# Altium project WOLF.PrjPcb
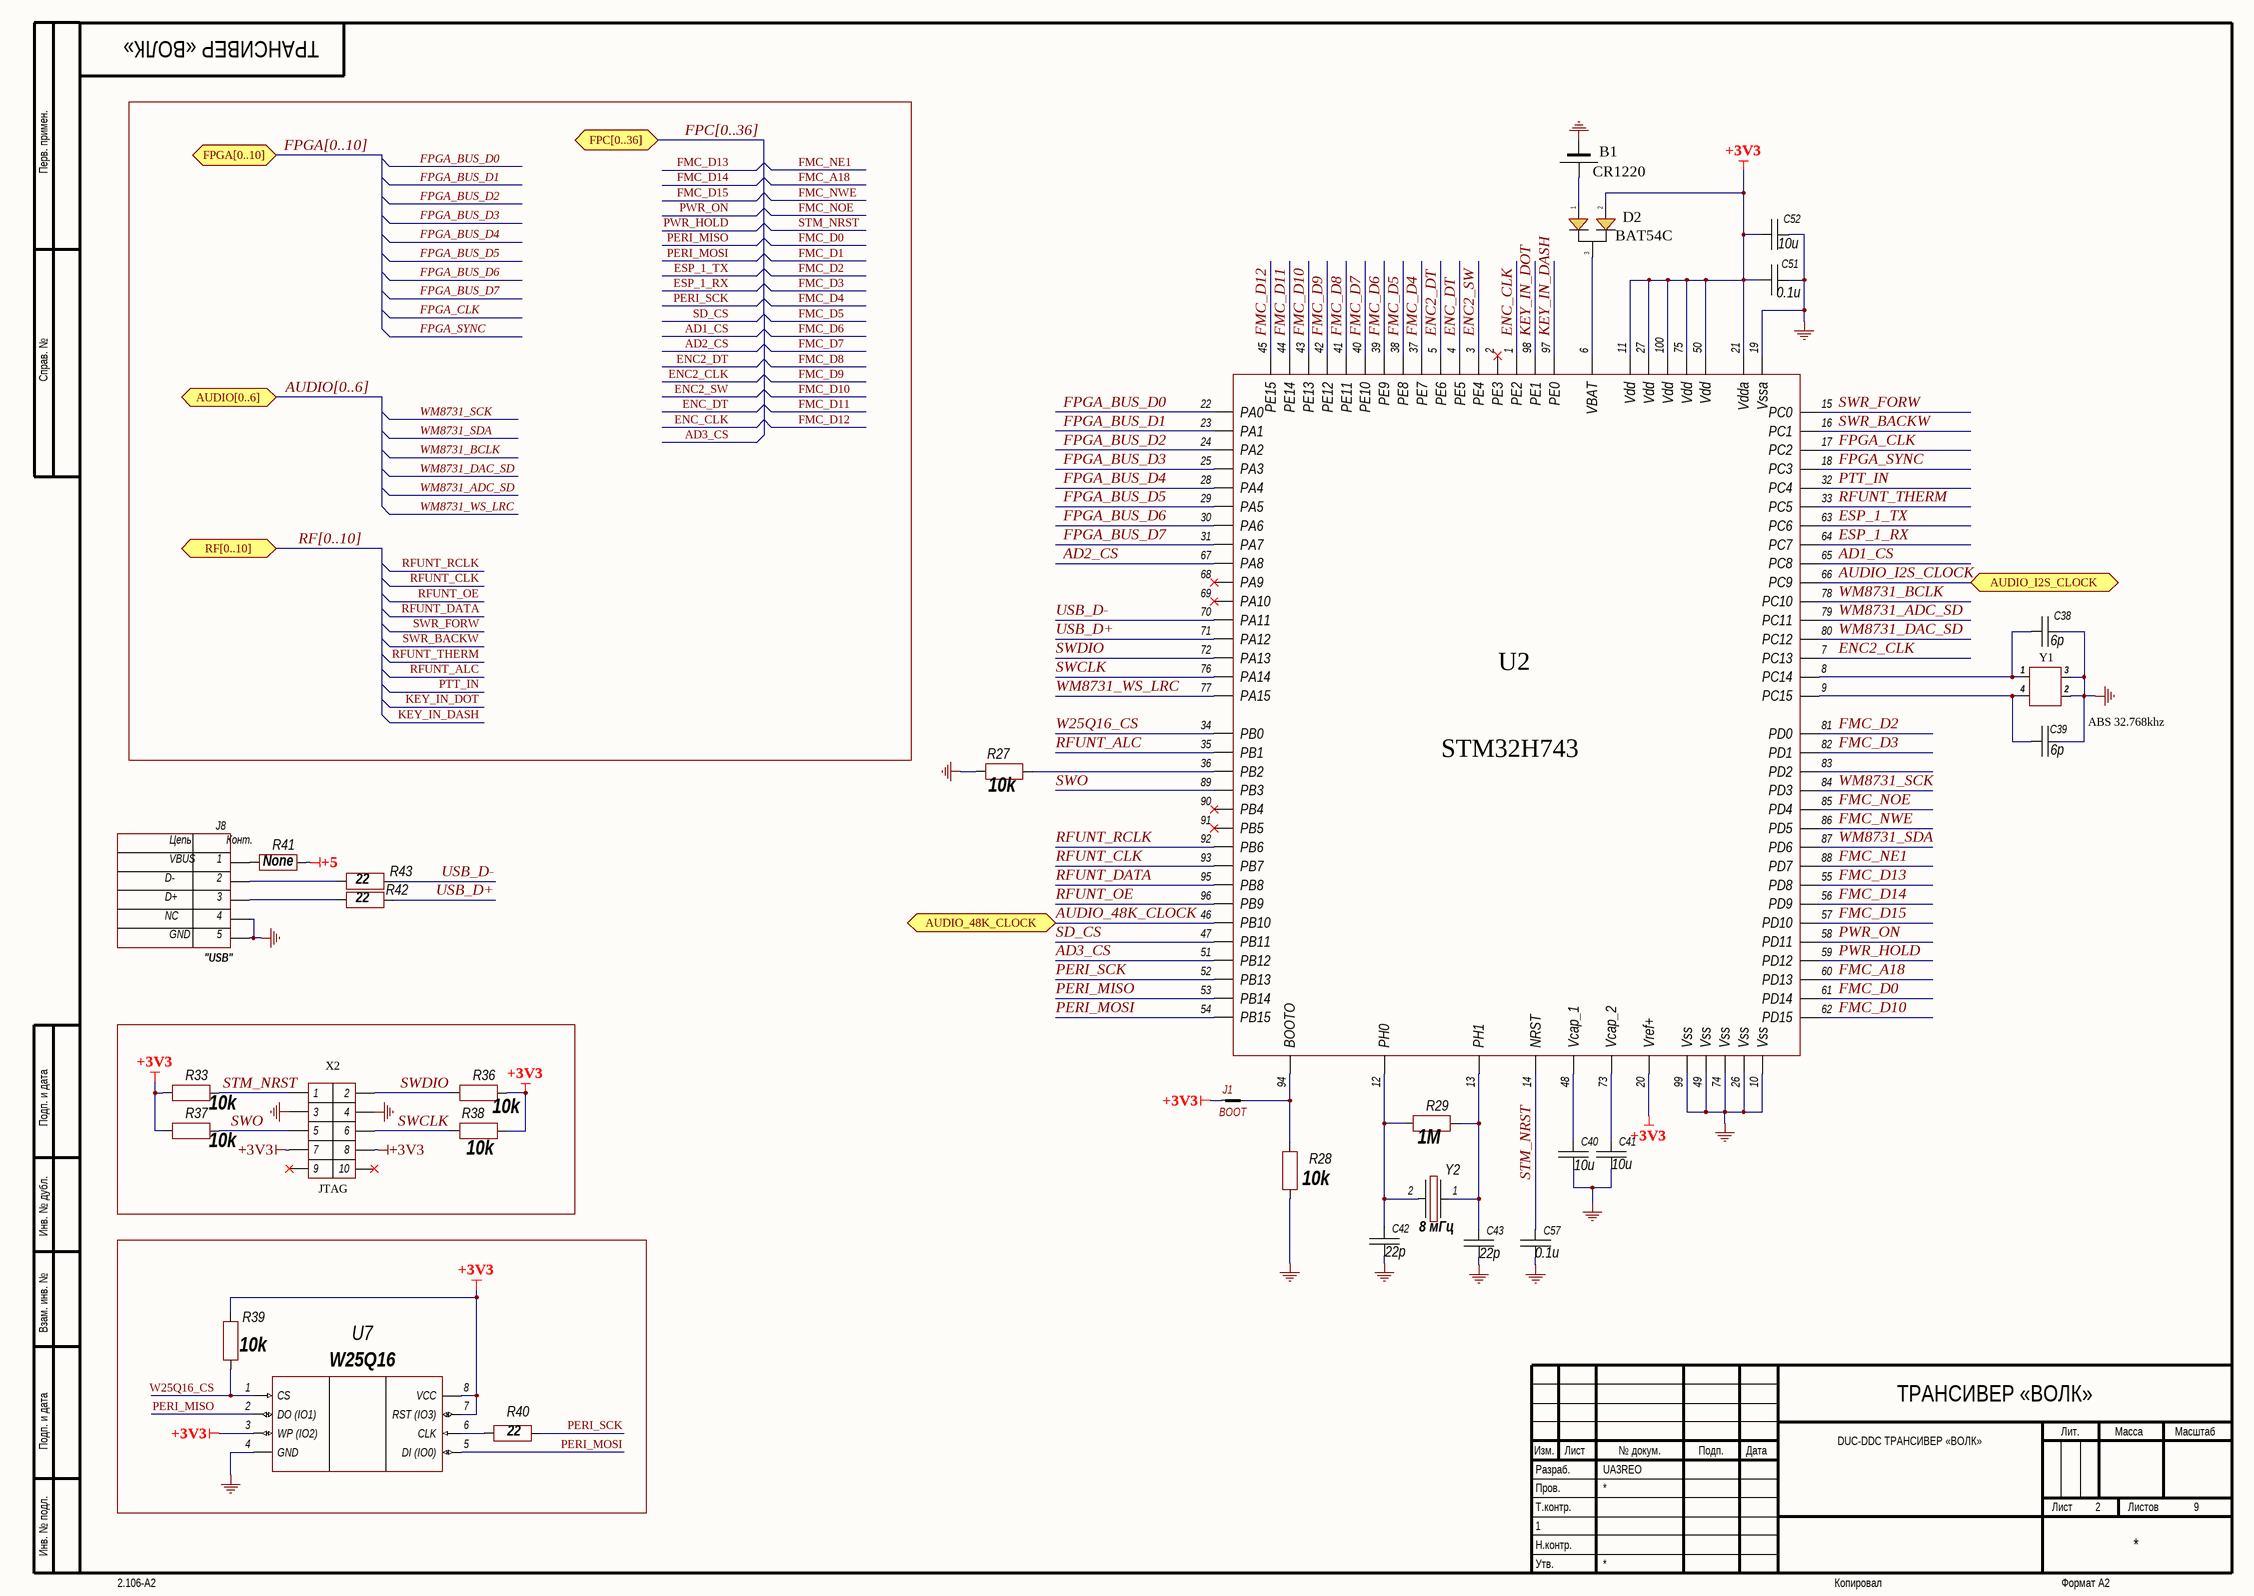
[diagram p0: WL-STM.SchDoc]
3 sheets, 75 parts. Net scope: global (net labels, ports and power ports of the same name join across sheets).
Board file: WOLF-MAIN.PcbDoc
Sheets:
  WL-STM.SchDoc
  WL-FPGA.SchDoc
  WL-GENERATOR.SchDoc

## Sheet WL-STM.SchDoc: DUC-DDC ТРАНСИВЕР «ВОЛК»
size 594 x 420 mm; Date: 16.10.2020; Author: UA3REO; DrawnBy: 1; Engineer: 1; Organization: 1; DocumentNumber: ТРАНСИВЕР «ВОЛК»; Revision: 1; SheetNumber: 2; SheetTotal: 9; Time: «ВОЛК»; Rule: 16.12.2020; ImagePath: 1

### Parts
B1  CR1220  [CR2032]
C38  6p  [CH0805C]
C39  6p  [CH0805C]
C40  10u  [CH0805C]
C41  10u  [CH0805C]
C42  22p  [CH0805C]
C43  22p  [CH0805C]
C51  0.1u  [CH0805C]
C52  10u  [CH0805C]
C57  0.1u  [CH0805C]
D2  BAT54C  [SOT23_132]
J1  BOOT  [CON: PLS-2]
J8  "USB"  [CON: 0675031020]
R27  10k  [CH0805R]
R28  10k  [CH0805R]
R29  1M  [CH0805R]
R33  10k  [CH0805R]
R36  10k  [CH0805R]
R37  10k  [CH0805R]
R38  10k  [CH0805R]
R39  10k  [CH0805R]
R40  22  [CH0805R]
R41  None  [CH0805R]
R42  22  [CH0805R]
R43  22  [CH0805R]
U2  STM32H743  [100-LQFP]
U7  W25Q16  [SOIC-8-1]
X2  JTAG  [CON: PLD-10]
Y1  ABS 32.768khz  [ABS-25]
Y2  8 мГц  [OSC-dip]

### Ports
AUDIO[0..6] (bidir), AUDIO_48K_CLOCK (bidir), AUDIO_I2S_CLOCK (bidir), FPC[0..36] (bidir), FPGA[0..10] (bidir), RF[0..10] (bidir)

### Nets
+3V3: C51.1 C52.1 D2.2 J1.2 R33.2 R36.1 R37.2 R38.1 R39.2 U2.11(Vdd) U2.20(Vref+) U2.21(Vdda) U2.27(Vdd) U2.50(Vdd) U2.75(Vdd) U2.100(Vdd) U7.3(WP_(IO2)) U7.7(RST_(IO3)) U7.8(VCC) X2.7 X2.8
+5: R41.1
GND: B1.2 C38.2 C39.2 C40.1 C41.1 C42.1 C43.1 C51.2 C52.2 C57.1 J8.4 J8.5 R27.2 R28.1 U2.10(Vss) U2.19(Vssa) U2.26(Vss) U2.49(Vss) U2.74(Vss) U2.99(Vss) U7.4(GND) X2.3 X2.4 Y1.2 Y1.3
AD1_CS: U2.65(PC8)
AD2_CS: U2.67(PA8)
AD3_CS: U2.51(PB12)
AUDIO_48K_CLOCK: U2.46(PB10) ; port AUDIO_48K_CLOCK
AUDIO_I2S_CLOCK: U2.66(PC9) ; port AUDIO_I2S_CLOCK
ENC2_CLK: U2.7(PC13)
ENC2_DT: U2.5(PE6)
ENC2_SW: U2.3(PE4)
ENC_CLK: U2.1(PE2)
ENC_DT: U2.4(PE5)
ESP_1_RX: U2.64(PC7)
ESP_1_TX: U2.63(PC6)
FMC_A18: U2.60(PD13)
FMC_D0: U2.61(PD14)
FMC_D2: U2.81(PD0)
FMC_D3: U2.82(PD1)
FMC_D4: U2.37(PE7)
FMC_D5: U2.38(PE8)
FMC_D6: U2.39(PE9)
FMC_D7: U2.40(PE10)
FMC_D8: U2.41(PE11)
FMC_D9: U2.42(PE12)
FMC_D10: U2.43(PE13) U2.62(PD15)
FMC_D11: U2.44(PE14)
FMC_D12: U2.45(PE15)
FMC_D13: U2.55(PD8)
FMC_D14: U2.56(PD9)
FMC_D15: U2.57(PD10)
FMC_NE1: U2.88(PD7)
FMC_NOE: U2.85(PD4)
FMC_NWE: U2.86(PD5)
FPGA_BUS_D0: U2.22(PA0)
FPGA_BUS_D1: U2.23(PA1)
FPGA_BUS_D2: U2.24(PA2)
FPGA_BUS_D3: U2.25(PA3)
FPGA_BUS_D4: U2.28(PA4)
FPGA_BUS_D5: U2.29(PA5)
FPGA_BUS_D6: U2.30(PA6)
FPGA_BUS_D7: U2.31(PA7)
FPGA_CLK: U2.17(PC2)
FPGA_SYNC: U2.18(PC3)
KEY_IN_DASH: U2.97(PE0)
KEY_IN_DOT: U2.98(PE1)
PERI_MISO: U2.53(PB14) U7.2(DO_(IO1))
PERI_MOSI: U2.54(PB15) U7.5(DI_(IO0))
PERI_SCK: R40.2 U2.52(PB13)
PTT_IN: U2.32(PC4)
PWR_HOLD: U2.59(PD12)
PWR_ON: U2.58(PD11)
RFUNT_ALC: U2.35(PB1)
RFUNT_CLK: U2.93(PB7)
RFUNT_DATA: U2.95(PB8)
RFUNT_OE: U2.96(PB9)
RFUNT_RCLK: U2.92(PB6)
RFUNT_THERM: U2.33(PC5)
SD_CS: U2.47(PB11)
STM_NRST: C57.2 U2.14(NRST)
SWCLK: R38.2 U2.76(PA14) X2.6
SWDIO: R36.2 U2.72(PA13) X2.2
SWO: R37.1 U2.89(PB3) X2.5
SWR_BACKW: U2.16(PC1)
SWR_FORW: U2.15(PC0)
USB_D+: R42.1 U2.71(PA12)
USB_D-: R43.1 U2.70(PA11)
W25Q16_CS: R39.1 U2.34(PB0) U7.1(CS)
WM8731_ADC_SD: U2.79(PC11)
WM8731_BCLK: U2.78(PC10)
WM8731_DAC_SD: U2.80(PC12)
WM8731_SCK: U2.84(PD3)
WM8731_SDA: U2.87(PD6)
WM8731_WS_LRC: U2.77(PA15)
NetB1_1: B1.1 D2.1
NetC38_1: C38.1 U2.8(PC14) Y1.1
NetC39_1: C39.1 U2.9(PC15) Y1.4
NetC40_2: C40.2 U2.48(Vcap_1)
NetC41_2: C41.2 U2.73(Vcap_2)
NetC42_2: C42.2 R29.2 U2.12(PH0) Y2.2
NetC43_2: C43.2 R29.1 U2.13(PH1) Y2.1
NetD2_3: D2.3 U2.6(VBAT)
NetJ1_1: J1.1 R28.2 U2.94(BOOTO)
NetJ8_1: J8.1 R41.2
NetJ8_2: J8.2 R43.2
NetJ8_3: J8.3 R42.2
NetR27_1: R27.1 U2.36(PB2)
NetR33_1: R33.1 X2.1
NetR40_1: R40.1 U7.6(CLK)

Not connected (* = marked no-connect by the designer): U2 2(PE3)* 68(PA9)* 69(PA10)* 83(PD2) 90(PB4)* 91(PB5)*; X2 9* 10*

### Buses and harness runs
bus AUDIO[0..6] = port AUDIO[0..6]
bus FPC[0..36] = port FPC[0..36]
bus FPGA[0..10] = port FPGA[0..10]
bus RF[0..10] = port RF[0..10]

### Notes on the sheet
- Labels drawn without touching a wire or pin: STM_NRST
- Перв. примен.
- Справ. №
- Подп. и дата
- Инв. № дубл.
- Взам. инв. №
- Разраб.
- Изм.
- Лист
- № докум.
- Подп.
- Дата
- Лит.
- Масса
- Масштаб
- Пров.
- Т.контр.
- Листов
- Инв. № подл.
- Утв.
- Н.контр.
- 2.106-A2
- Копировал
- Формат А2
- (in symbol miniUSB-B) Цепь; Конт.; VBUS; D-; D+; NC; GND

### Library data of the parts
B1 = POWER_BAT
C38-C43 C51 C52 C57 = Capacitor: Manufacturer: *; Model: *; HelpURL: *; ComponentKind: *; Value: *
J1 = DJAMPER
J8 = miniUSB-B: USB; Manufacturer: *; Model: *; HelpURL: *; ComponentKind: *
R27-R29 R33 R36-R43 = Resistor: Manufacturer: *; Model: *; HelpURL: *; ComponentKind: *; Value: *
U7 = W25Q32JVZPIQ: Flash; Manufacturer: Winbond Electronics; Model: W25Q32JVZPIQ; HelpURL: https://www.digikey.com/product-detail/en/winbond-electronics/W25Q32JVZPIQ/W25Q32JVZPIQ-ND/6167525; ComponentKind: 8-WSON
Y1 = ABS25
Y2 = Oscillator: Manufacturer: *; Model: *; HelpURL: *; ComponentKind: *; Value: *

## Sheet WL-FPGA.SchDoc
size 594 x 420 mm; DocumentNumber: ТРАНСИВЕР «ВОЛК»; SheetNumber: 3; SheetTotal: 3
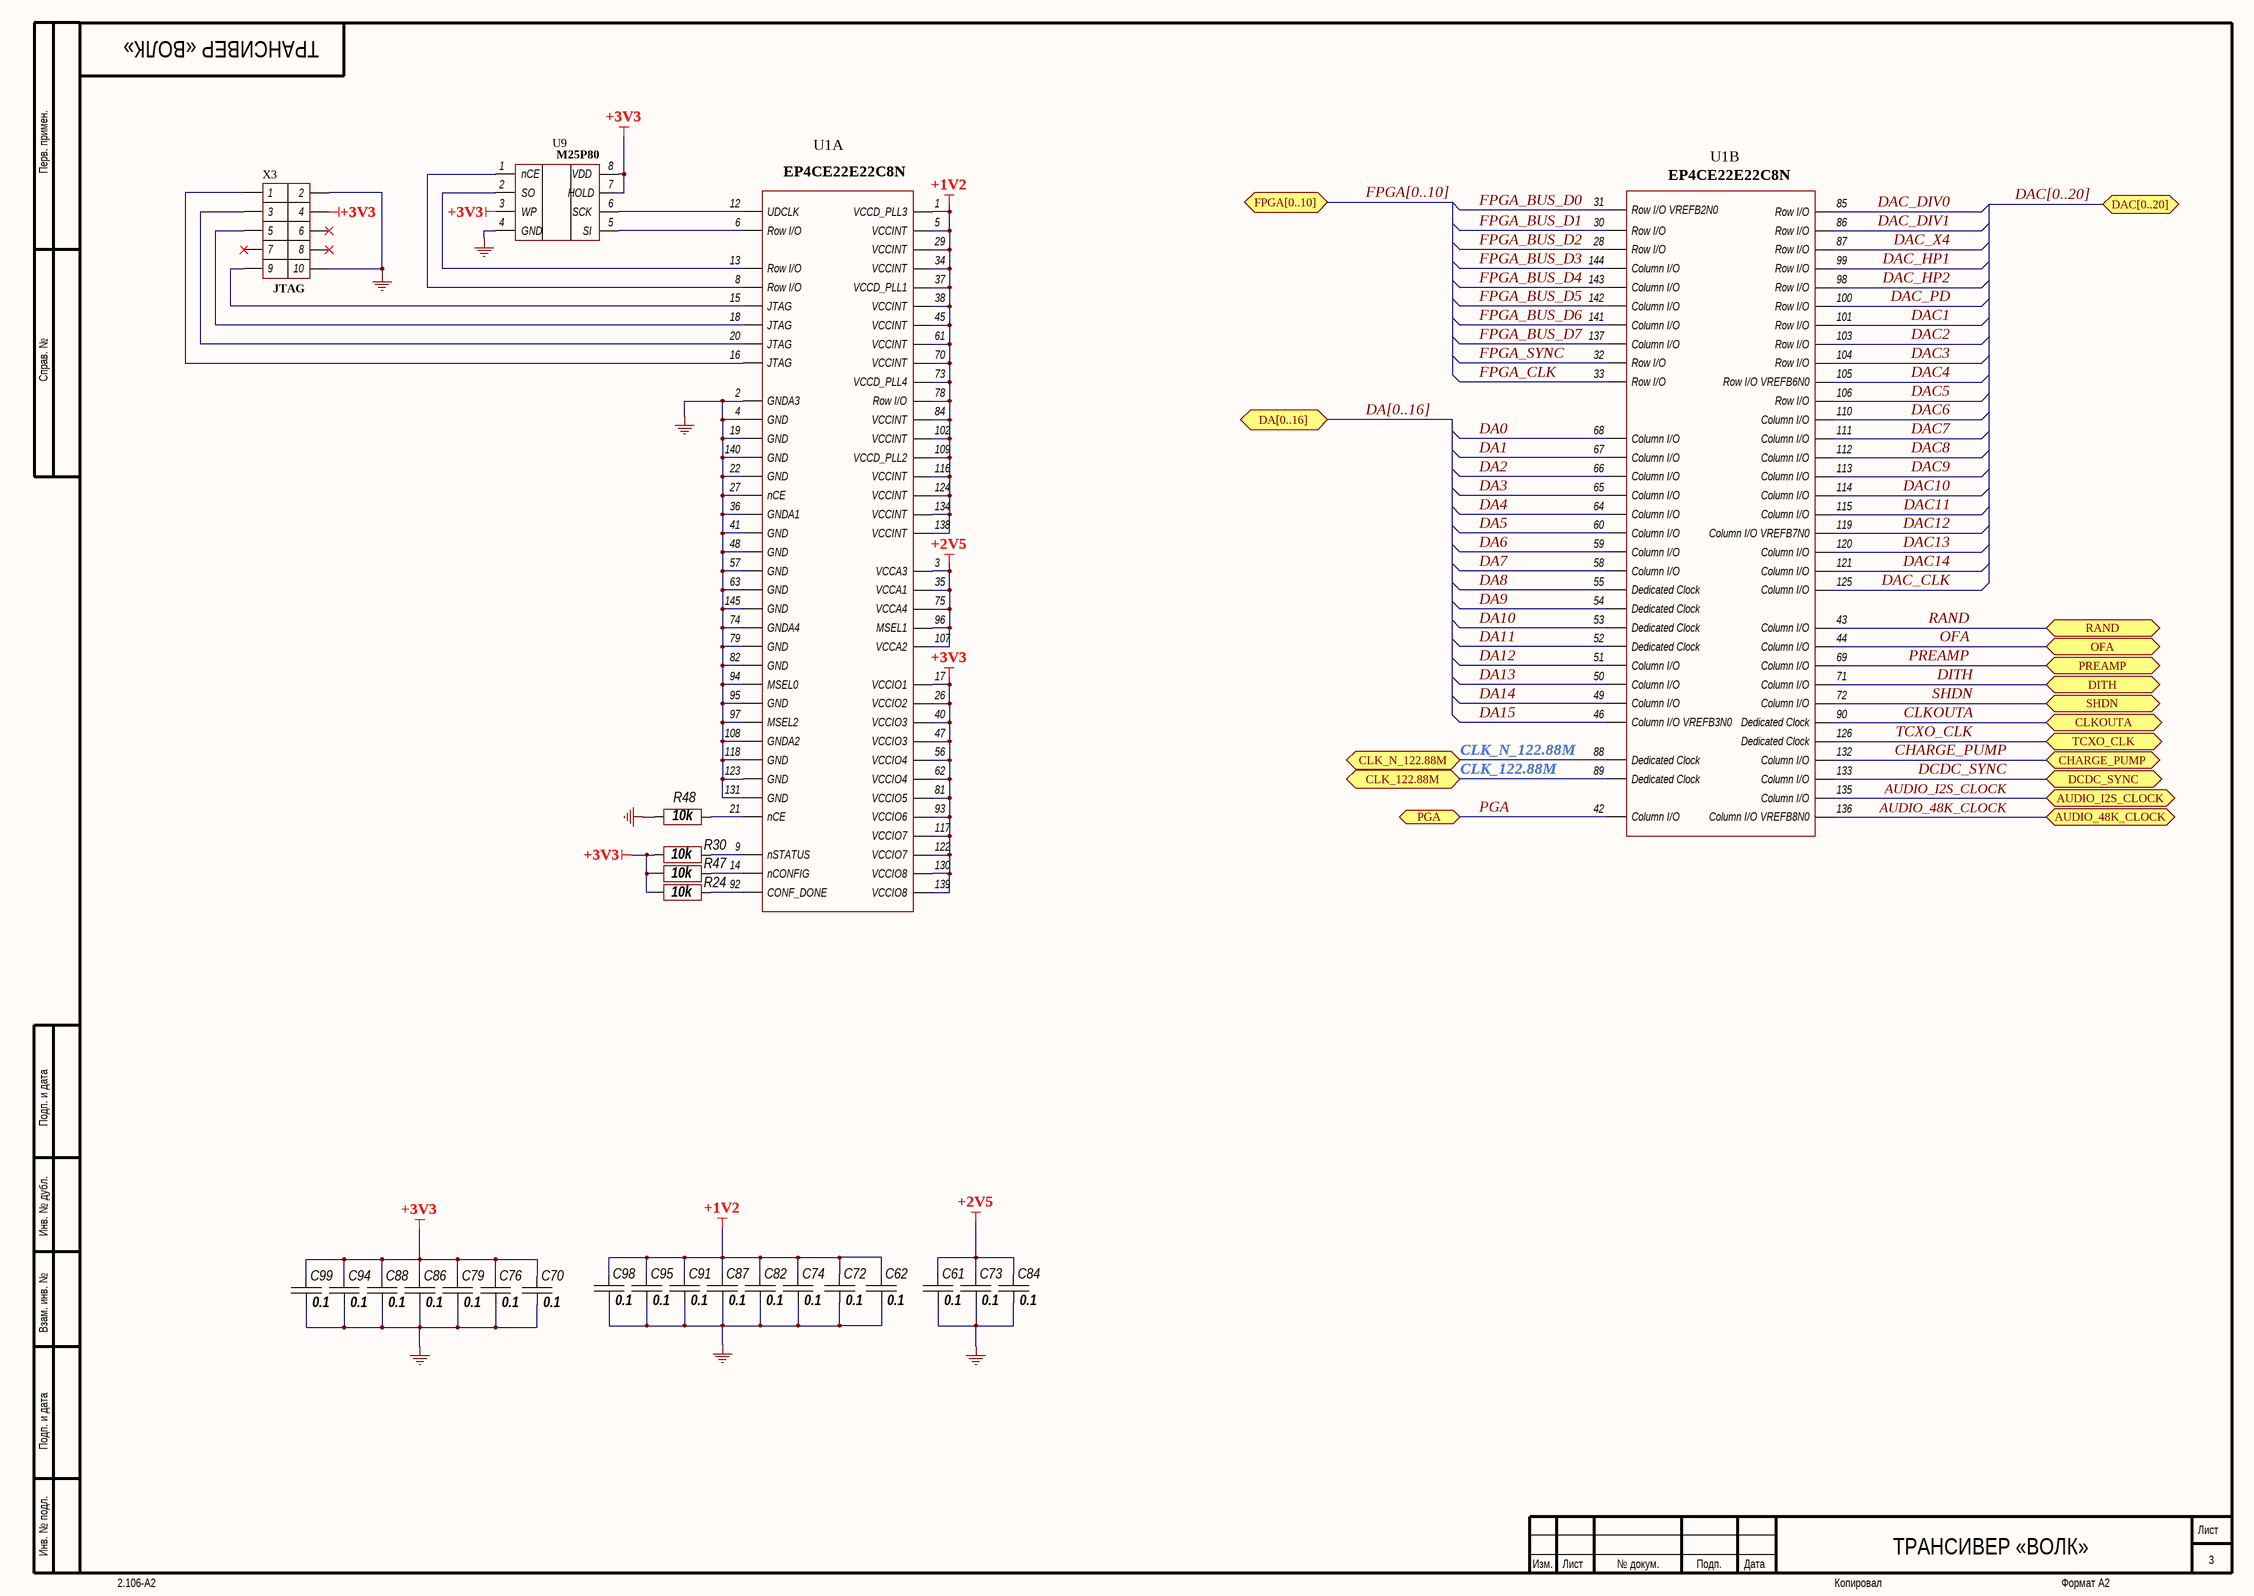
[diagram p1: WL-FPGA.SchDoc]

### Parts
C61  0.1  [CH0805C]
C62  0.1  [CH0805C]
C70  0.1  [CH0805C]
C72  0.1  [CH0805C]
C73  0.1  [CH0805C]
C74  0.1  [CH0805C]
C76  0.1  [CH0805C]
C79  0.1  [CH0805C]
C82  0.1  [CH0805C]
C84  0.1  [CH0805C]
C86  0.1  [CH0805C]
C87  0.1  [CH0805C]
C88  0.1  [CH0805C]
C91  0.1  [CH0805C]
C94  0.1  [CH0805C]
C95  0.1  [CH0805C]
C98  0.1  [CH0805C]
C99  0.1  [CH0805C]
R24  10k  [CH0805R]
R30  10k  [CH0805R]
R47  10k  [CH0805R]
R48  10k  [CH0805R]
U1  EP4CE22E22C8N  [144-QFN]  (parts A,B of 3)
U9  M25P80  [8-SOIC]
X3  JTAG  [CON: PLD-10]

### Ports
AUDIO_48K_CLOCK (bidir), AUDIO_I2S_CLOCK (bidir), CHARGE_PUMP (bidir), CLK_122.88M (bidir), CLK_N_122.88M (bidir), CLKOUTA (bidir), DA[0..16] (bidir), DAC[0..20] (bidir), DCDC_SYNC (bidir), DITH (bidir), FPGA[0..10] (bidir), OFA (bidir), PGA (bidir), PREAMP (bidir), RAND (bidir), SHDN (bidir), TCXO_CLK (bidir)

### Nets
+1V2: C62.2 C72.2 C74.2 C82.2 C87.2 C91.2 C95.2 C98.2 U1.1(VCCD_PLL3) U1.5(VCCINT) U1.29(VCCINT) U1.34(VCCINT) U1.37(VCCD_PLL1) U1.38(VCCINT) U1.45(VCCINT) U1.61(VCCINT) U1.70(VCCINT) U1.73(VCCD_PLL4) U1.78(Row_I/O) U1.84(VCCINT) U1.102(VCCINT) U1.109(VCCD_PLL2) U1.116(VCCINT) U1.124(VCCINT) U1.134(VCCINT) U1.138(VCCINT)
+2V5: C61.2 C73.2 C84.2 U1.3(VCCA3) U1.35(VCCA1) U1.75(VCCA4) U1.96(MSEL1) U1.107(VCCA2)
+3V3: C70.2 C76.2 C79.2 C86.2 C88.2 C94.2 C99.2 R24.2 R30.2 R47.2 U1.17(VCCIO1) U1.26(VCCIO2) U1.40(VCCIO3) U1.47(VCCIO3) U1.56(VCCIO4) U1.62(VCCIO4) U1.81(VCCIO5) U1.93(VCCIO6) U1.117(VCCIO7) U1.122(VCCIO7) U1.130(VCCIO8) U1.139(VCCIO8) U9.3(WP) U9.7(HOLD) U9.8(VDD) X3.4
GND: C61.1 C62.1 C70.1 C72.1 C73.1 C74.1 C76.1 C79.1 C82.1 C84.1 C86.1 C87.1 C88.1 C91.1 C94.1 C95.1 C98.1 C99.1 R48.2 U1.2(GNDA3) U1.4(GND) U1.19(GND) U1.22(GND) U1.27(nCE) U1.36(GNDA1) U1.41(GND) U1.48(GND) U1.57(GND) U1.63(GND) U1.74(GNDA4) U1.79(GND) U1.82(GND) U1.94(MSEL0) U1.95(GND) U1.97(MSEL2) U1.108(GNDA2) U1.118(GND) U1.123(GND) U1.131(GND) U1.140(GND) U1.145(GND) U9.4(GND) X3.2 X3.10
AUDIO_48K_CLOCK: U1.136(Column_I/O_VREFB8N0) ; port AUDIO_48K_CLOCK
AUDIO_I2S_CLOCK: U1.135(Column_I/O) ; port AUDIO_I2S_CLOCK
CHARGE_PUMP: U1.132(Column_I/O) ; port CHARGE_PUMP
CLK_122.88M: U1.89(Dedicated_Clock) ; port CLK_122.88M
CLK_N_122.88M: U1.88(Dedicated_Clock) ; port CLK_N_122.88M
CLKOUTA: U1.90(Dedicated_Clock) ; port CLKOUTA
DA0: U1.68(Column_I/O)
DA1: U1.67(Column_I/O)
DA2: U1.66(Column_I/O)
DA3: U1.65(Column_I/O)
DA4: U1.64(Column_I/O)
DA5: U1.60(Column_I/O)
DA6: U1.59(Column_I/O)
DA7: U1.58(Column_I/O)
DA8: U1.55(Dedicated_Clock)
DA9: U1.54(Dedicated_Clock)
DA10: U1.53(Dedicated_Clock)
DA11: U1.52(Dedicated_Clock)
DA12: U1.51(Column_I/O)
DA13: U1.50(Column_I/O)
DA14: U1.49(Column_I/O)
DA15: U1.46(Column_I/O_VREFB3N0)
DAC1: U1.101(Row_I/O)
DAC2: U1.103(Row_I/O)
DAC3: U1.104(Row_I/O)
DAC4: U1.105(Row_I/O_VREFB6N0)
DAC5: U1.106(Row_I/O)
DAC6: U1.110(Column_I/O)
DAC7: U1.111(Column_I/O)
DAC8: U1.112(Column_I/O)
DAC9: U1.113(Column_I/O)
DAC10: U1.114(Column_I/O)
DAC11: U1.115(Column_I/O)
DAC12: U1.119(Column_I/O_VREFB7N0)
DAC13: U1.120(Column_I/O)
DAC14: U1.121(Column_I/O)
DAC_CLK: U1.125(Column_I/O)
DAC_DIV0: U1.85(Row_I/O)
DAC_DIV1: U1.86(Row_I/O)
DAC_HP1: U1.99(Row_I/O)
DAC_HP2: U1.98(Row_I/O)
DAC_PD: U1.100(Row_I/O)
DAC_X4: U1.87(Row_I/O)
DCDC_SYNC: U1.133(Column_I/O) ; port DCDC_SYNC
DITH: U1.71(Column_I/O) ; port DITH
FPGA_BUS_D0: U1.31(Row_I/O_VREFB2N0)
FPGA_BUS_D1: U1.30(Row_I/O)
FPGA_BUS_D2: U1.28(Row_I/O)
FPGA_BUS_D3: U1.144(Column_I/O)
FPGA_BUS_D4: U1.143(Column_I/O)
FPGA_BUS_D5: U1.142(Column_I/O)
FPGA_BUS_D6: U1.141(Column_I/O)
FPGA_BUS_D7: U1.137(Column_I/O)
FPGA_CLK: U1.33(Row_I/O)
FPGA_SYNC: U1.32(Row_I/O)
OFA: U1.44(Column_I/O) ; port OFA
PGA: U1.42(Column_I/O) ; port PGA
PREAMP: U1.69(Column_I/O) ; port PREAMP
RAND: U1.43(Column_I/O) ; port RAND
SHDN: U1.72(Column_I/O) ; port SHDN
TCXO_CLK: U1.126(Dedicated_Clock) ; port TCXO_CLK
NetR24_1: R24.1 U1.92(CONF_DONE)
NetR30_1: R30.1 U1.9(nSTATUS)
NetR47_1: R47.1 U1.14(nCONFIG)
NetR48_1: R48.1 U1.21(nCE)
NetU1_6: U1.6(Row_I/O) U9.5(SI)
NetU1_8: U1.8(Row_I/O) U9.1(nCE)
NetU1_12: U1.12(UDCLK) U9.6(SCK)
NetU1_13: U1.13(Row_I/O) U9.2(SO)
NetU1_15: U1.15(JTAG) X3.9
NetU1_16: U1.16(JTAG) X3.1
NetU1_18: U1.18(JTAG) X3.5
NetU1_20: U1.20(JTAG) X3.3

Not connected (* = marked no-connect by the designer): X3 6* 7* 8*

### Buses and harness runs
bus DA[0..16] = port DA[0..16]
bus DAC[0..20] = port DAC[0..20]
bus FPGA[0..10] = port FPGA[0..10]

### Notes on the sheet
- Перв. примен.
- Справ. №
- Подп. и дата
- Инв. № дубл.
- Взам. инв. №
- Инв. № подл.
- Изм.
- Лист
- № докум.
- Подп.
- Дата
- 2.106-A2
- Копировал
- Формат А2

### Library data of the parts
C61 C62 C70 C72-C74 C76 C79 C82 C84 C86-C88 C91 C94 C95 C98 C99 = Capacitor: Manufacturer: *; Model: *; HelpURL: *; ComponentKind: *; Value: *
R24 R30 R47 R48 = Resistor: Manufacturer: *; Model: *; HelpURL: *; ComponentKind: *; Value: *
U1 = EP4CE22E22C8N-№1

## Sheet WL-GENERATOR.SchDoc
size 420 x 297 mm; Address1: Address1; Address2: Address2; Address3: Address3; Address4: Address4; DocumentNumber: ТРАНСИВЕР «ВОЛК»; SheetNumber: 7; Scale: 1:1; DocumentType: Схема электрическая принципиальная; FirstReferrence: АБВГ.123456.001
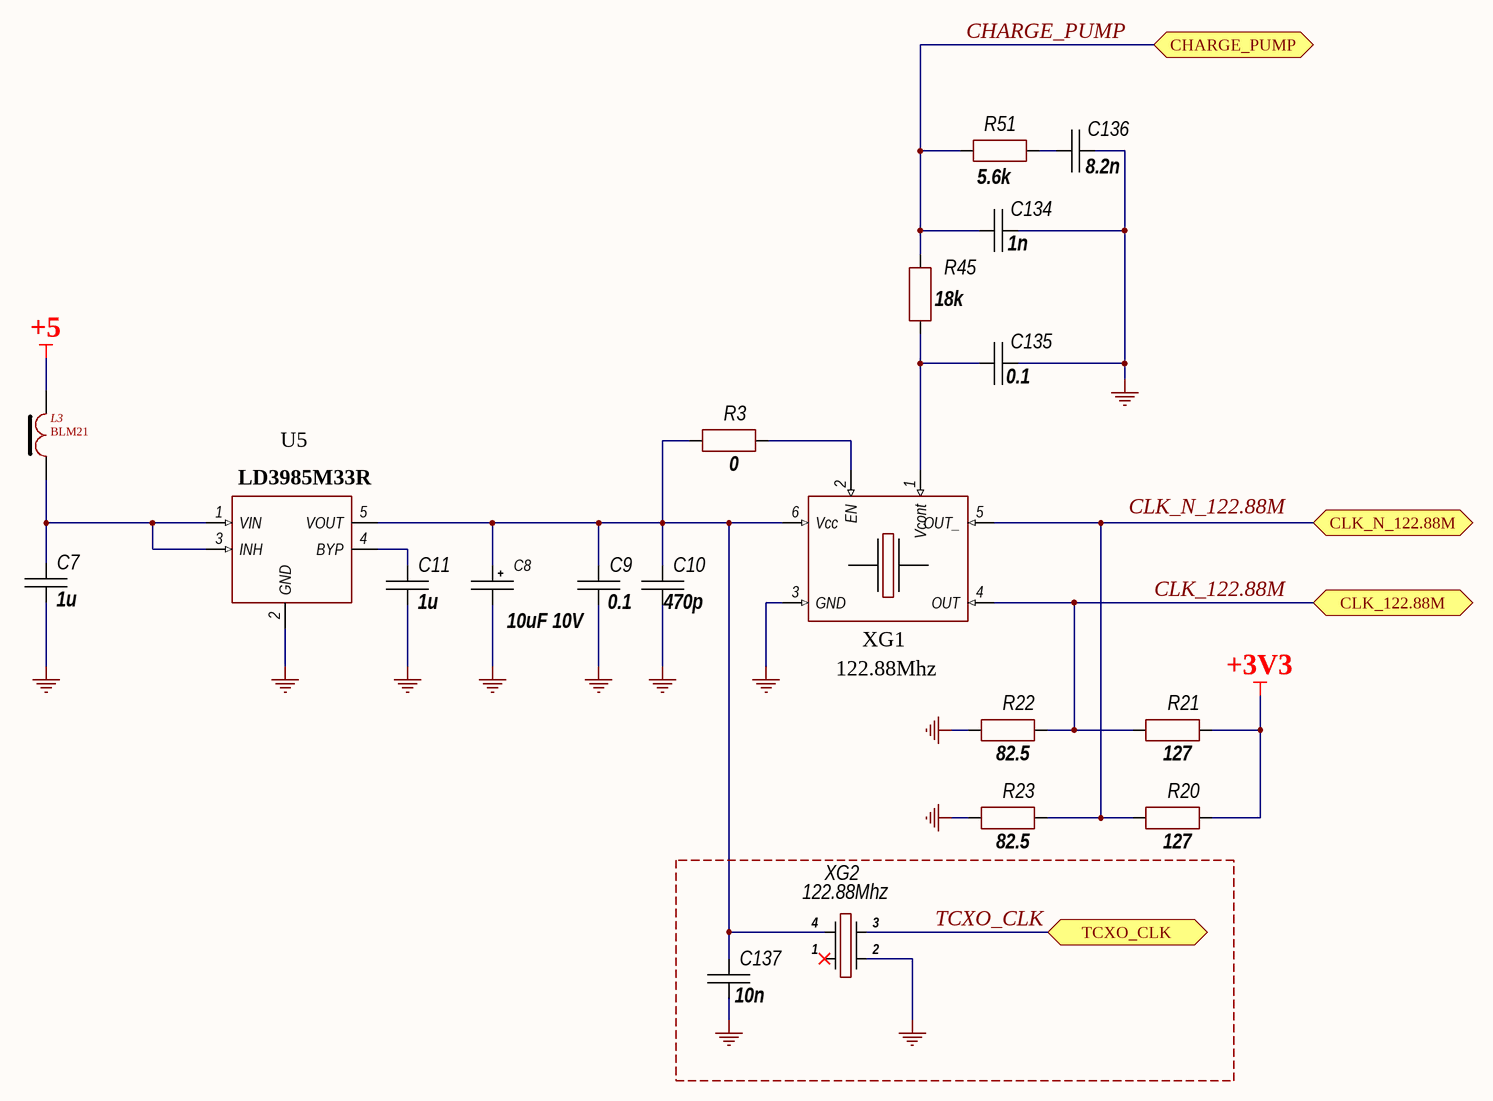
[diagram p2: WL-GENERATOR.SchDoc]

### Parts
C7  1u  [CH0805C]
C8  10uF 10V  [TANTAL_B]
C9  0.1  [CH0805C]
C10  470p  [CH0805C]
C11  1u  [CH0805C]
C134  1n  [CH0805C]
C135  0.1  [CH0805C]
C136  8.2n  [CH0805C]
C137  10n  [CH0805C]
L3  BLM21  [CH0805L]
R3  0  [CH0805R]
R20  127  [CH0805R]
R21  127  [CH0805R]
R22  82.5  [CH0805R]
R23  82.5  [CH0805R]
R45  18k  [CH0805R]
R51  5.6k  [CH0805R]
U5  LD3985M33R  [SOT23-5]
XG1  122.88Mhz
XG2  122.88Mhz  [OSC: 5070]

### Ports
CHARGE_PUMP (bidir), CLK_122.88M (bidir), CLK_N_122.88M (bidir), TCXO_CLK (bidir)

### Nets
+3V3: R20.1 R21.1
+5: L3.1
GND: C7.2 C8.2 C9.2 C10.2 C11.2 C134.2 C135.2 C136.2 C137.2 R22.2 R23.2 U5.2(GND) XG1.3(GND) XG2.2
CHARGE_PUMP: C134.1 R45.1 R51.1 ; port CHARGE_PUMP
CLK_122.88M: R21.2 R22.1 XG1.4(OUT) ; port CLK_122.88M
CLK_N_122.88M: R20.2 R23.1 XG1.5(OUT_) ; port CLK_N_122.88M
TCXO_CLK: XG2.3 ; port TCXO_CLK
NetC7_1: C7.1 L3.2 U5.1(VIN) U5.3(INH)
NetC8_1: C8.1 C9.1 C10.1 C137.1 R3.2 U5.5(VOUT) XG1.6(Vcc) XG2.4
NetC11_1: C11.1 U5.4(BYP)
NetC135_1: C135.1 R45.2 XG1.1(Vcont)
NetC136_1: C136.1 R51.2
NetR3_1: R3.1 XG1.2(EN)

Not connected (* = marked no-connect by the designer): XG2 1*

### Notes on the sheet
- Labels drawn without touching a wire or pin: CLK_N_122.88M
- Подп. и дата
- Инв. № дубл.
- Взам. инв. №
- Инв. № подл.
- Изм.
- Лист
- № докум.
- Подп.
- Дата
- 2.106-A3
- Копировал
- Формат А3

### Library data of the parts
C7 C9-C11 C134-C137 = Capacitor: Manufacturer: *; Model: *; HelpURL: *; ComponentKind: *; Value: *
C8 = TantalCap: Manufacturer: *; Model: *; HelpURL: *; ComponentKind: *; Value: *
L3 = FB-1
R3 R20-R23 R45 R51 = Resistor: Manufacturer: *; Model: *; HelpURL: *; ComponentKind: *; Value: *
U5 = LD3985M33R_SOT23
XG1 XG2 = Generator
  XG2: Manufacturer: *; Model: *; HelpURL: *; ComponentKind: *; Value: *

## Nets that join several sheets
+3V3: WL-STM (21 pins), WL-FPGA (26 pins), WL-GENERATOR (R20.1 R21.1)
+5: WL-STM (R41.1), WL-GENERATOR (L3.1)
GND: WL-STM (25 pins), WL-FPGA (44 pins), WL-GENERATOR (14 pins)
AUDIO_48K_CLOCK: WL-STM (U2.46), WL-FPGA (U1.136)
AUDIO_I2S_CLOCK: WL-STM (U2.66), WL-FPGA (U1.135)
CHARGE_PUMP: WL-FPGA (U1.132), WL-GENERATOR (C134.1 R45.1 R51.1)
CLK_122.88M: WL-FPGA (U1.89), WL-GENERATOR (R21.2 R22.1 XG1.4)
CLK_N_122.88M: WL-FPGA (U1.88), WL-GENERATOR (R20.2 R23.1 XG1.5)
FPGA_BUS_D0: WL-STM (U2.22), WL-FPGA (U1.31)
FPGA_BUS_D1: WL-STM (U2.23), WL-FPGA (U1.30)
FPGA_BUS_D2: WL-STM (U2.24), WL-FPGA (U1.28)
FPGA_BUS_D3: WL-STM (U2.25), WL-FPGA (U1.144)
FPGA_BUS_D4: WL-STM (U2.28), WL-FPGA (U1.143)
FPGA_BUS_D5: WL-STM (U2.29), WL-FPGA (U1.142)
FPGA_BUS_D6: WL-STM (U2.30), WL-FPGA (U1.141)
FPGA_BUS_D7: WL-STM (U2.31), WL-FPGA (U1.137)
FPGA_CLK: WL-STM (U2.17), WL-FPGA (U1.33)
FPGA_SYNC: WL-STM (U2.18), WL-FPGA (U1.32)
TCXO_CLK: WL-FPGA (U1.126), WL-GENERATOR (XG2.3)